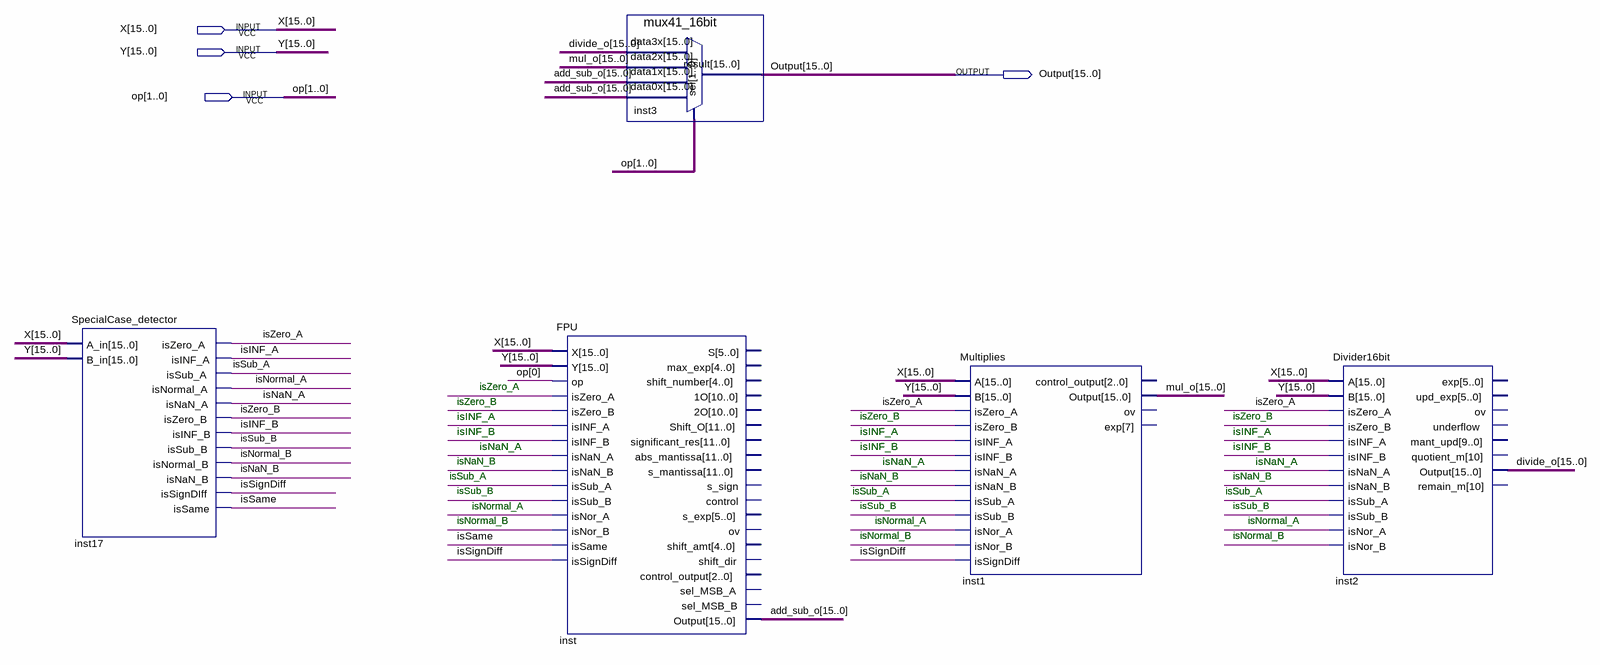
[diagram p0: schematic sheet]
// Quartus schematic FPU_Unit.bdf as structural Verilog: 5 symbols, 4 pins
module FPU_Unit (
  input  [15:0] X,
  input  [15:0] Y,
  input  [1:0] op,
  output [15:0] Output
);

  wire isINF_A, isINF_B, isNaN_A, isNaN_B, isNormal_A, isNormal_B, isSame, isSignDiff, isSub_A, isSub_B,
       isZero_A, isZero_B;
  wire [15:0] add_sub_o, divide_o, mul_o;

  SpecialCase_detector inst17 (
    .A_in(X), .B_in(Y), .isZero_A(isZero_A), .isINF_A(isINF_A), .isSub_A(isSub_A), .isNormal_A(isNormal_A),
    .isNaN_A(isNaN_A), .isZero_B(isZero_B), .isINF_B(isINF_B), .isSub_B(isSub_B), .isNormal_B(isNormal_B),
    .isNaN_B(isNaN_B), .isSignDIff(isSignDiff), .isSame(isSame));
  FPU inst (
    .X(X), .Y(Y), .op(op[0]), .isZero_A(isZero_A), .isZero_B(isZero_B), .isINF_A(isINF_A), .isINF_B(isINF_B),
    .isNaN_A(isNaN_A), .isNaN_B(isNaN_B), .isSub_A(isSub_A), .isSub_B(isSub_B), .isNor_A(isNormal_A),
    .isNor_B(isNormal_B), .isSame(isSame), .isSignDiff(isSignDiff), .Output(add_sub_o));  // open: S, max_exp, shift_number, 1O, 2O, Shift_O, significant_res, abs_mantissa, s_mantissa, s_sign, control, s_exp, ov, shift_amt, shift_dir, control_output, sel_MSB_A, sel_MSB_B
  mux41_16bit inst3 (
    .data3x(divide_o), .data2x(mul_o), .data1x(add_sub_o), .data0x(add_sub_o), .sel(op), .result(Output));
  Multiplies inst1 (
    .A(X), .B(Y), .isZero_A(isZero_A), .isZero_B(isZero_B), .isINF_A(isINF_A), .isINF_B(isINF_B),
    .isNaN_A(isNaN_A), .isNaN_B(isNaN_B), .isSub_A(isSub_A), .isSub_B(isSub_B), .isNor_A(isNormal_A),
    .isNor_B(isNormal_B), .isSignDiff(isSignDiff), .Output(mul_o));  // open: control_output, ov, exp
  Divider16bit inst2 (
    .A(X), .B(Y), .isZero_A(isZero_A), .isZero_B(isZero_B), .isINF_A(isINF_A), .isINF_B(isINF_B),
    .isNaN_A(isNaN_A), .isNaN_B(isNaN_B), .isSub_A(isSub_A), .isSub_B(isSub_B), .isNor_A(isNormal_A),
    .isNor_B(isNormal_B), .Output(divide_o));  // open: exp, upd_exp, ov, underflow, mant_upd, quotient_m, remain_m

  // Notes on the sheet:
  //   isZero_A
  //   isZero_B
  //   isINF_A
  //   isZero_B
  //   isZero_B
  //   isINF_B
  //   isINF_A
  //   isINF_A
  //   isNaN_A
  //   isINF_B
  //   isINF_B
  //   isNaN_B
  //   isNaN_A
  //   isNaN_A
  //   isSub_A
  //   isNaN_B
  //   isNaN_B
  //   isSub_B
  //   isSub_A
  //   isSub_A
  //   isNormal_A
  //   isSub_B
  //   isSub_B
  //   isNormal_B
  //   isNormal_A
  //   isNormal_A
  //   isNormal_B
  //   isNormal_B
endmodule
